# Altium schematic sheet TOP.SchDoc
size A3; SheetNumber: 3; SheetTotal: 11
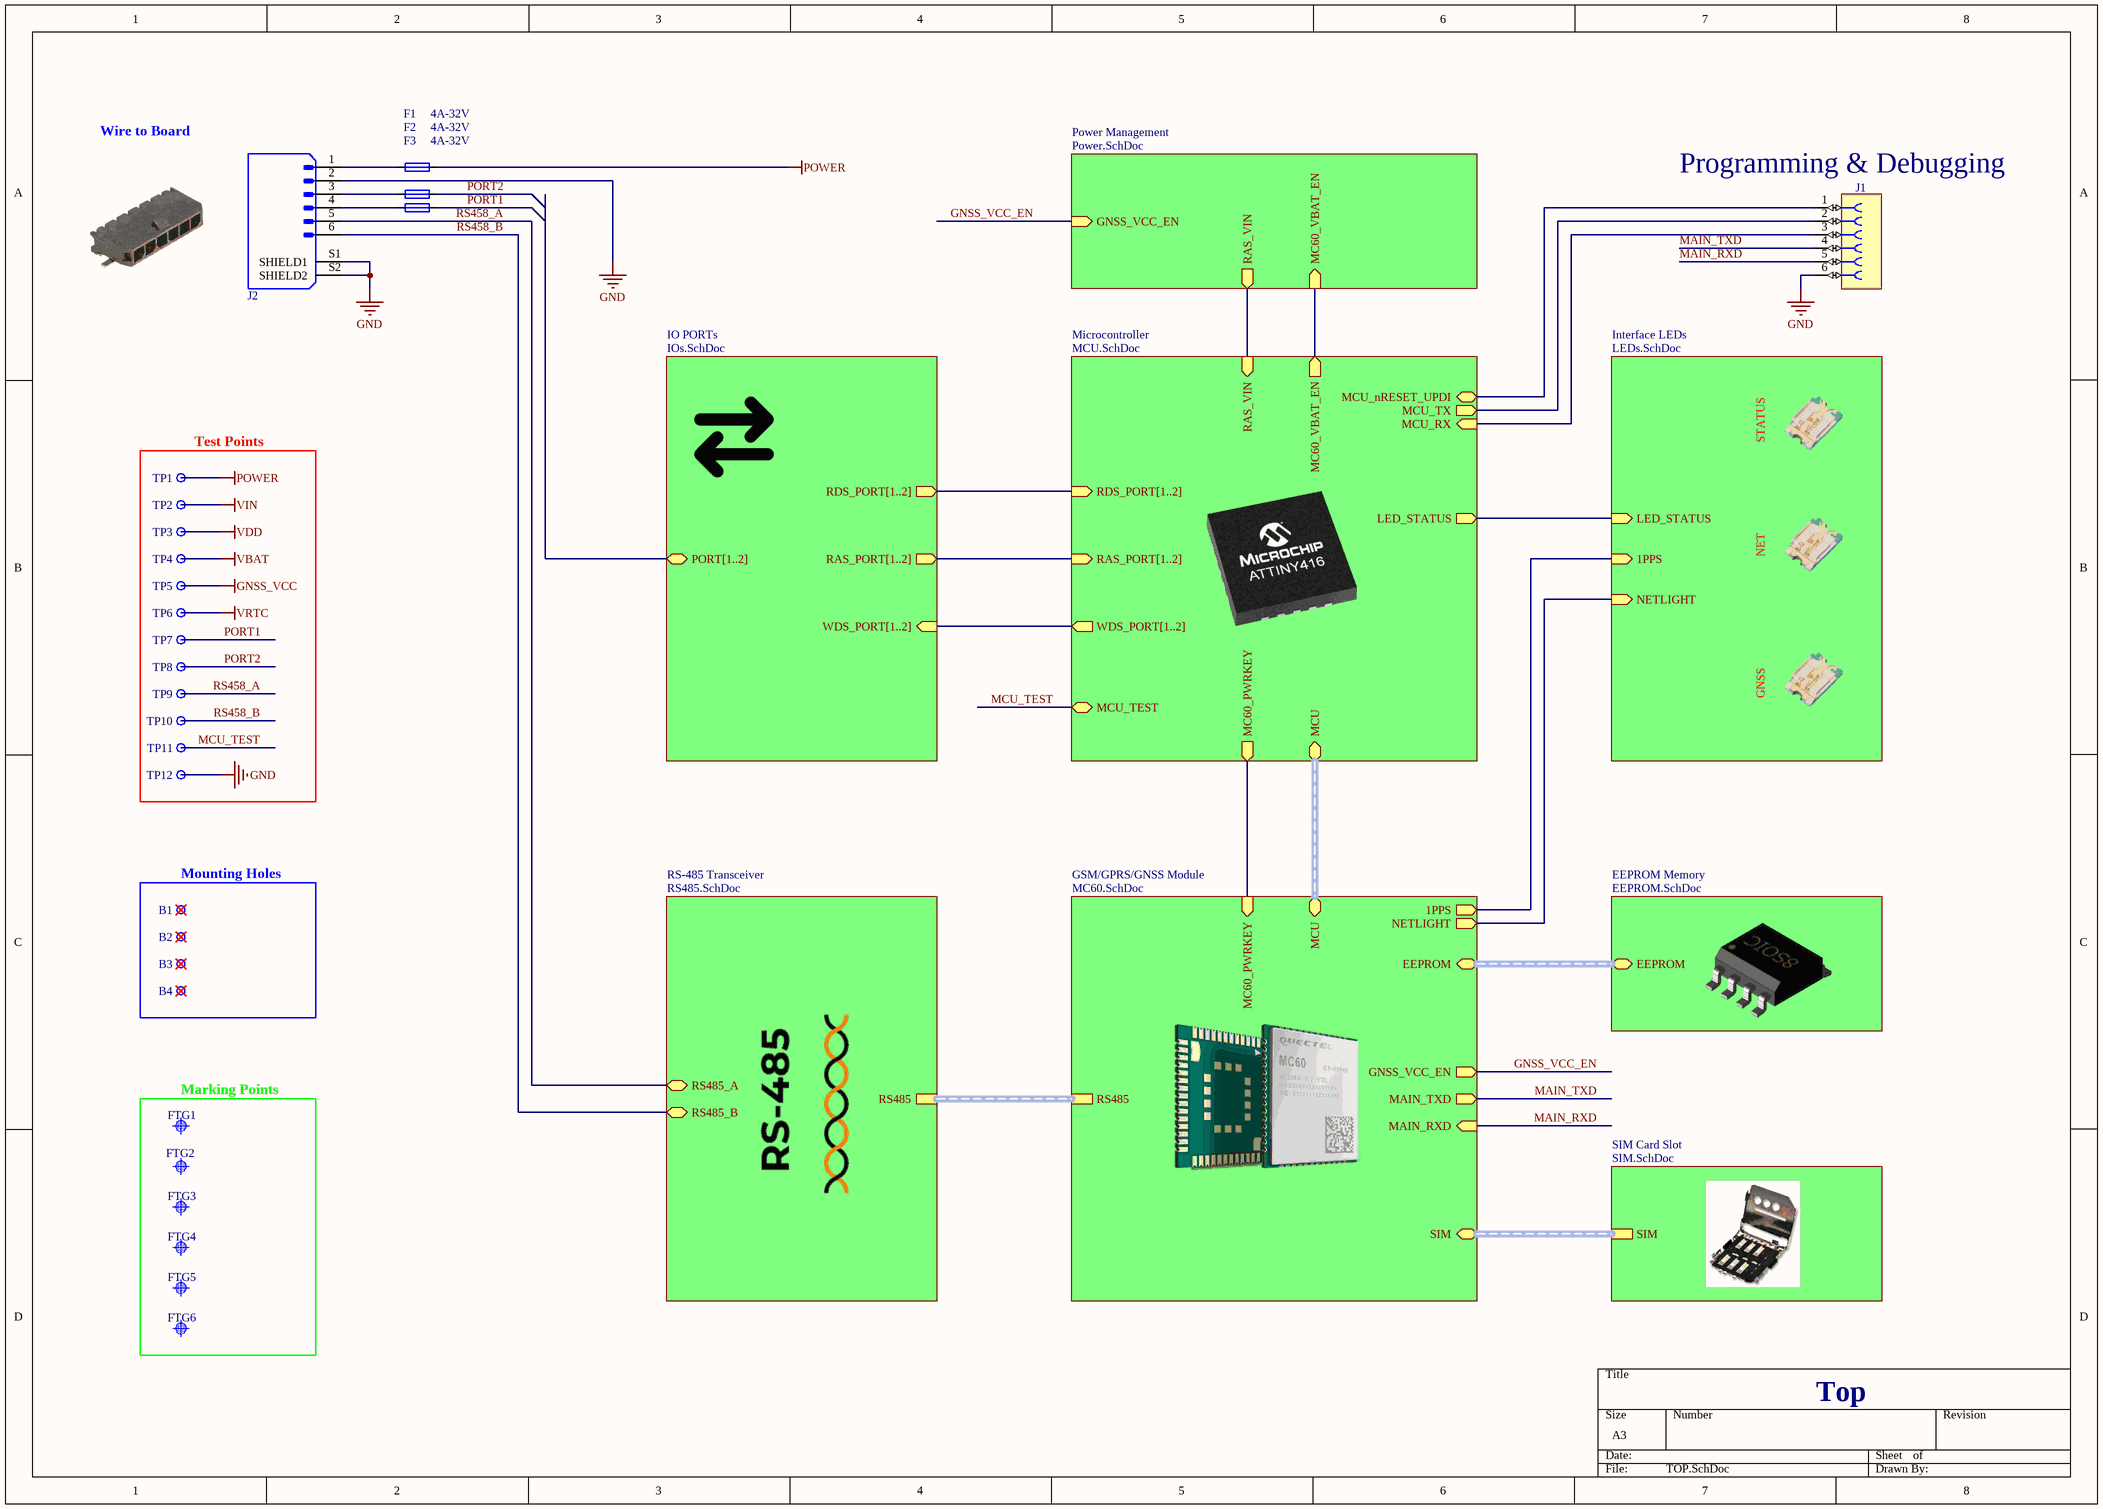
[diagram p0: TOP.SchDoc]

## Parts
B1  Non Plated Hole  [MTG520]  (value not drawn)  (no BOM)
B2  Non Plated Hole  [MTG520]  (value not drawn)  (no BOM)
B3  Non Plated Hole  [MTG520]  (value not drawn)  (no BOM)
B4  Non Plated Hole  [MTG520]  (value not drawn)  (no BOM)
F1  4A-32V  [FUSC_LITTELFUSE_466]
F2  4A-32V  [FUSC_LITTELFUSE_466]
F3  4A-32V  [FUSC_LITTELFUSE_466]
FTG1  Use only in PCB  [FIDUCIAL_TOP_C100-200]  (value not drawn)
FTG2  Use only in PCB  [FIDUCIAL_TOP_C100-200]  (value not drawn)
FTG3  Use only in PCB  [FIDUCIAL_TOP_C100-200]  (value not drawn)
FTG4  Use only in PCB  [FIDUCIAL_TOP_C100-200]  (value not drawn)
FTG5  Use only in PCB  [FIDUCIAL_TOP_C100-200]  (value not drawn)
FTG6  Use only in PCB  [FIDUCIAL_TOP_C100-200]  (value not drawn)
J1  Socket 6  [SAMTEC_SSW-106-01-L-S]  (value not drawn)
J2  43650-0613  [MOLEX_43650-0613]  (value not drawn)
TP1  Test Point  [TPS127]  (value not drawn)
TP2  Test Point  [TPS127]  (value not drawn)
TP3  Test Point  [TPS127]  (value not drawn)
TP4  Test Point  [TPS127]  (value not drawn)
TP5  Test Point  [TPS127]  (value not drawn)
TP6  Test Point  [TPS127]  (value not drawn)
TP7  Test Point  [TPS127]  (value not drawn)
TP8  Test Point  [TPS127]  (value not drawn)
TP9  Test Point  [TPS127]  (value not drawn)
TP10  Test Point  [TPS127]  (value not drawn)
TP11  Test Point  [TPS127]  (value not drawn)
TP12  Test Point  [TPS127]  (value not drawn)

## Blocks framed on the sheet
Test Points: TP1-TP12
Mounting Holes: B1-B4
Marking Points: FTG1-FTG6

## Sub-sheets
EEPROM Memory = EEPROM.SchDoc: EEPROM (bidir, harness EEPROM)
GSM/GPRS/GNSS Module = MC60.SchDoc: SIM (bidir, harness SIM), EEPROM (bidir, harness EEPROM), RS485 (harness RS485), MCU (bidir, harness MCU), MC60_PWRKEY (in), NETLIGHT (out), GNSS_VCC_EN (out), 1PPS (out), MAIN_TXD (out), MAIN_RXD (in)
Interface LEDs = LEDs.SchDoc: LED_STATUS (in), 1PPS (in), NETLIGHT (in)
IO PORTs = IOs.SchDoc: WDS_PORT[1..2] (in), RAS_PORT[1..2] (out), RDS_PORT[1..2] (out), PORT[1..2] (bidir)
Microcontroller = MCU.SchDoc: MCU (bidir, harness MCU), MC60_PWRKEY (out), LED_STATUS (out), RDS_PORT[1..2] (in), RAS_PORT[1..2] (in), WDS_PORT[1..2] (out), MC60_VBAT_EN (out), RAS_VIN (in), MCU_nRESET_UPDI (bidir), MCU_TEST (bidir), MCU_TX (out), MCU_RX (in)
Power Management = Power.SchDoc: GNSS_VCC_EN (in), MC60_VBAT_EN (in), RAS_VIN (out)
RS-485 Transceiver = RS485.SchDoc: RS485_A (bidir), RS485_B (bidir), RS485 (harness RS485)
SIM Card Slot = SIM.SchDoc: SIM (harness SIM)

## Nets
GND: J1.6 J2.2 J2.S1(SHIELD1) J2.S2(SHIELD2) TP12.1
GNSS_VCC: TP5.1
POWER: F1.2 TP1.1
VBAT: TP4.1
VDD: TP3.1
VIN: TP2.1
VRTC: TP6.1
GNSS_VCC_EN: sheet GSM/GPRS/GNSS Module/GNSS_VCC_EN, sheet Power Management/GNSS_VCC_EN
MAIN_RXD: J1.5 ; sheet GSM/GPRS/GNSS Module/MAIN_RXD
MAIN_TXD: J1.4 ; sheet GSM/GPRS/GNSS Module/MAIN_TXD
MCU_TEST: TP11.1 ; sheet Microcontroller/MCU_TEST
PORT1: F3.2 TP7.1
PORT2: F2.2 TP8.1
RS458_A: J2.5 TP9.1 ; sheet RS-485 Transceiver/RS485_A
RS458_B: J2.6 TP10.1 ; sheet RS-485 Transceiver/RS485_B
NetF1_1: F1.1 J2.1
NetF2_1: F2.1 J2.3
NetF3_1: F3.1 J2.4
NetJ1_1: J1.1 ; sheet Microcontroller/MCU_nRESET_UPDI
NetJ1_2: J1.2 ; sheet Microcontroller/MCU_TX
NetJ1_3: J1.3 ; sheet Microcontroller/MCU_RX
(unnamed): sheet GSM/GPRS/GNSS Module/MC60_PWRKEY, sheet Microcontroller/MC60_PWRKEY
(unnamed): sheet GSM/GPRS/GNSS Module/NETLIGHT, sheet Interface LEDs/NETLIGHT
(unnamed): sheet GSM/GPRS/GNSS Module/1PPS, sheet Interface LEDs/1PPS
(unnamed): sheet Microcontroller/LED_STATUS, sheet Interface LEDs/LED_STATUS
(unnamed): sheet Microcontroller/MC60_VBAT_EN, sheet Power Management/MC60_VBAT_EN
(unnamed): sheet Microcontroller/RAS_VIN, sheet Power Management/RAS_VIN

Not connected (* = marked no-connect by the designer): B1 1*; B2 1*; B3 1*; B4 1*

## Buses and harness runs
bus sheet IO PORTs/RAS_PORT[1..2] = sheet Microcontroller/RAS_PORT[1..2]
bus sheet IO PORTs/RDS_PORT[1..2] = sheet Microcontroller/RDS_PORT[1..2]
bus sheet IO PORTs/WDS_PORT[1..2] = sheet Microcontroller/WDS_PORT[1..2]
harness sheet EEPROM Memory/EEPROM = sheet GSM/GPRS/GNSS Module/EEPROM
harness sheet GSM/GPRS/GNSS Module/MCU = sheet Microcontroller/MCU
harness sheet GSM/GPRS/GNSS Module/RS485 = sheet RS-485 Transceiver/RS485
harness sheet GSM/GPRS/GNSS Module/SIM = sheet SIM Card Slot/SIM

## Notes on the sheet
- Wire to Board
- (near J1) Programming & Debugging
- STATUS
- NET
- GNSS
- Top

## Library data of the parts
B1-B4 = NON-PLATED_HOLE5.2: Single Terminal Socket; Part Description: Non Plated Through Hole: Hole Dia.=5.2mm; Mounted: No; Part Number: NON-PLATED_HOLE5.2; Component Type: Standard (No BOM); Pin Count: 1; Family: Non Plated Hole; Socket: No; SMD: No; Sense: No; Status: None; ComponentHeight: 0mm; HelpURL: Undefined; Author: CERN DEM JMW; CreateDate: 27.09.2011; LatestRevisionDate: 27.09.2011; PackageDescription: Non Plated Through Hole: Hole Dia.=5.2mm
F1-F3 = FUS1206_LITTELFUSE_0466004.NR: Fuse; Part Description: Very Fast-Acting Surface Mount Thin Film Fuse, Size 1206, Series 466; PressFit: No; Part Number: FUS1206_LITTELFUSE_0466004.NR; Component Kind: Standard; Component Type: Standard; Pin Count: 2; Case: 1206; PackageDescription: Very Fast-Acting Surface Mount Thin Film Fuse, Size 1206, 466 Series; Family: Fuse; Mounted: Yes; Socket: No; SMD: Yes; Sense: No; Value: 4A-32V; Manufacturer: LITTELFUSE; Manufacturer Part Number: 0466004.NR; ComponentHeight: 0.66mm; HelpURL: \\cern.ch\dfs\Applications\Altium\Datasheets\FUSE_LITTELFUSE_466.pdf; Author: CERN DEM BC; CreateDate: 23.04.2020; LatestRevisionDate: 23.04.2020
FTG1-FTG6 = FIDUCIAL_TARGET_C100-200: Fiducial Target; Part Description: Round Fiducial Target, Top Layer, 1.0mm, Top Solder 2.0mm, Keepout =2.0mm; Mounted: No; Part Number: FIDUCIAL_TARGET_C100-200; Component Kind: Standard (No BOM); Component Type: Standard (No BOM); Pin Count: 1; Family: Fiducial; Socket: No; SMD: Yes; Sense: No; Status: None; ComponentHeight: 0mm; HelpURL: Undefined; Author: CERN DEM JLC; CreateDate: 09.02.2010; LatestRevisionDate: 04.04.2012; PackageDescription: Round Fiducial Target, Top Layer, 1.0mm, Top Solder 2.0mm, Keepout =2.0mm
J1 = SAMTEC_SSW-106-01-L-S: Connector 6 Female; Part Description: 6 Contacts, Pitch 2.54mm, Single Row Through Mount Straight Socket (Lead Length 2.64mm); Manufacturer: OPEN; PressFit: No; Part Number: SAMTEC_SSW-106-01-L-S; Component Kind: Standard; Component Type: Standard; Pin Count: 6; Family: Socket 6; Mounted: Yes; Socket: No; SMD: No; Sense: No; Status: None; Manufacturer Part Number: OPEN; ComponentHeight: 8.51mm; HelpURL: \\cern.ch\dfs\Applications\Altium\Datasheets\SAMTEC_SSW-106-01-L-S.pdf; Author: CERN DEM BC; CreateDate: 29.09.2021; LatestRevisionDate: 29.09.2021
J2 = MOLEX_43650-0613: Connector Header Surface Mount, Right Angle 6 position 0.118" (3.00mm); Manufacturer: MOLEX; MP: 436500613; PressFit: No; Availability: Unavailable; Price: None; Package: None; Value: *; Part Number: MOLEX_43650-0613; Component Kind: Standard; Component Type: Standard; Pin Count: 6; Family: Micro-Fit 3.0 43650; Mounted: Yes; Socket: No; SMD: Yes; Sense: No; Status: None; Part Description: Connector Header Surface Mount, Right Angle 6 position 0.118" (3.00mm); Manufacturer Part Number: 43650-0613; ComponentHeight: 1.2mm; HelpURL: https://tools.molex.com/pdm_docs/sd/436500613_sd.pdf; Author: Xusniyor; CreateDate: 30.04.2023; LatestRevisionDate: 30.04.2023
TP1-TP12 = SMD_PAD_1.27X1.27MM: Part Description: 1.27mm x 1.27mm PCB Copper Area (SMD Test Point); Mounted: No; Part Number: SMD_PAD_1.27X1.27MM; Component Kind: Standard (No BOM); Component Type: Standard (No BOM); Pin Count: 1; Family: Test Point; Socket: No; SMD: No; Sense: No; Status: None; ComponentHeight: 0mm; HelpURL: Undefined; Author: CERN DEM JLC; CreateDate: 12.01.2008; LatestRevisionDate: 12.01.2008; PackageDescription: 1.27mm x 1.27mm PCB Copper Area (SMD Test Point)